# Altium schematic sheet GPIO_Shunt.SchDoc
size 209 x 297 mm
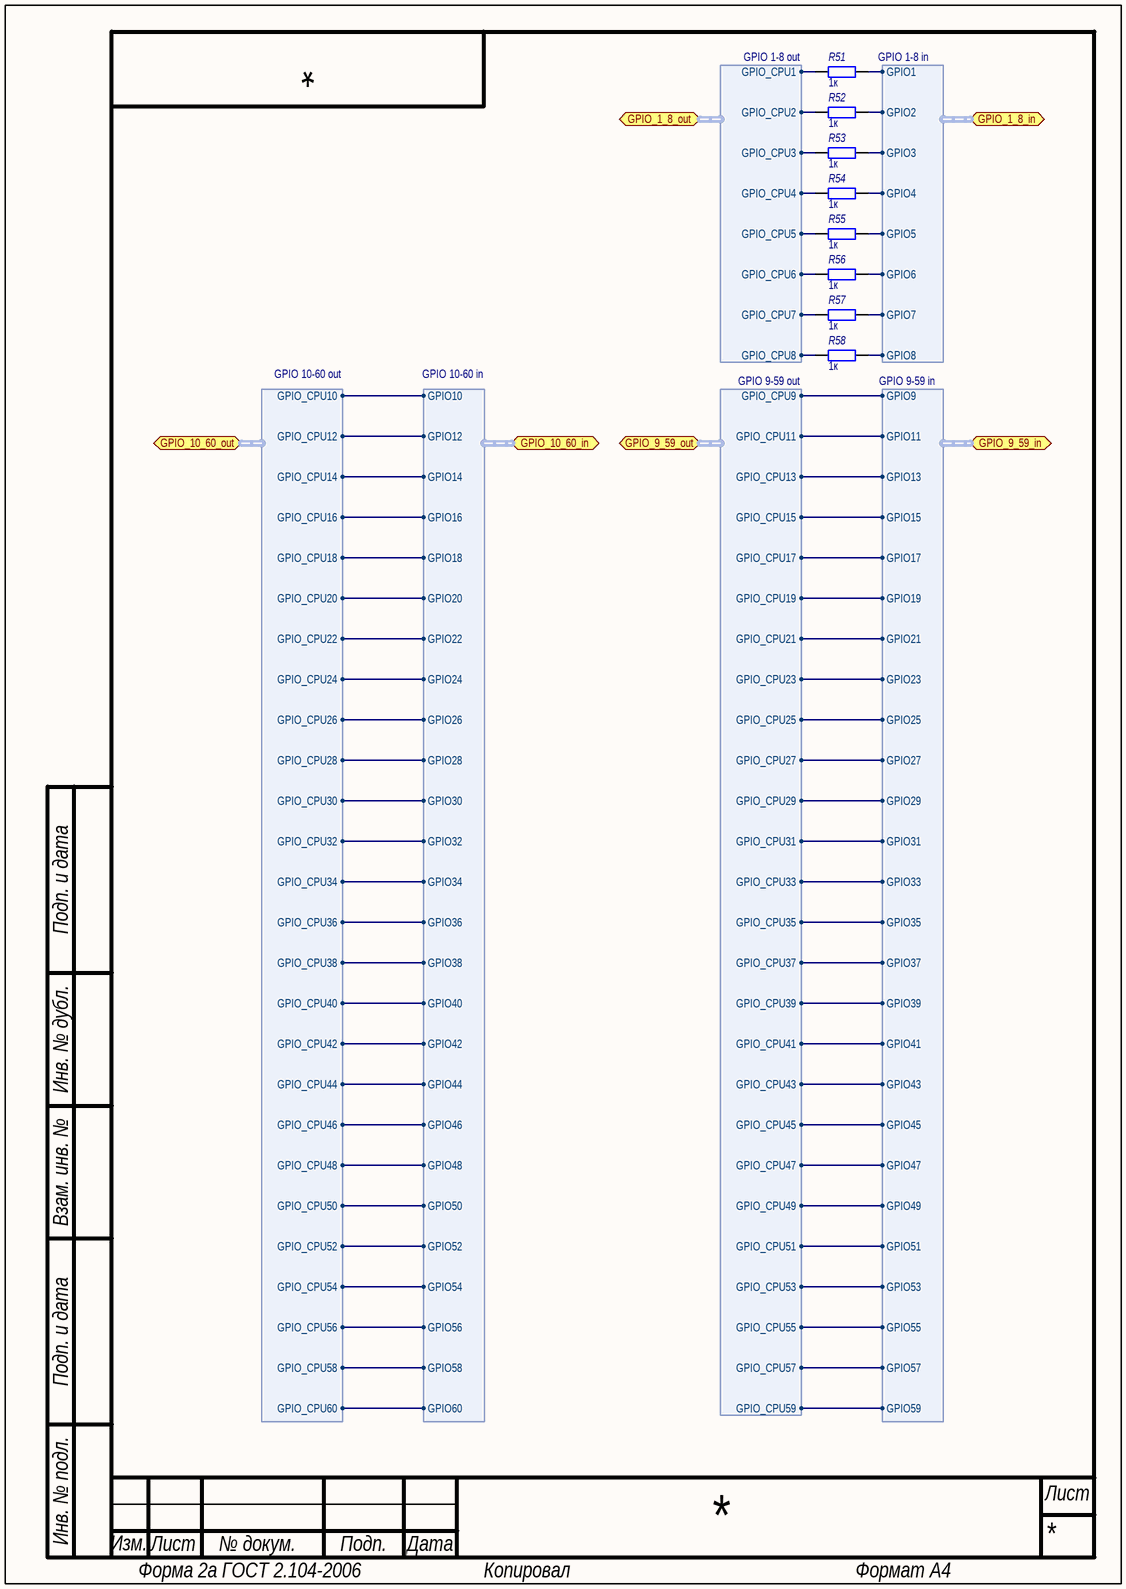
[diagram p0: GPIO_Shunt.SchDoc]

## Parts
R51  1к  [SMD_0603]
R52  1к  [SMD_0603]
R53  1к  [SMD_0603]
R54  1к  [SMD_0603]
R55  1к  [SMD_0603]
R56  1к  [SMD_0603]
R57  1к  [SMD_0603]
R58  1к  [SMD_0603]

## Ports
GPIO_1_8_in (bidir, harness GPIO 1-8 in), GPIO_1_8_out (bidir, harness GPIO 1-8 out), GPIO_9_59_in (bidir, harness GPIO 9-59 in), GPIO_9_59_out (bidir, harness GPIO 9-59 out), GPIO_10_60_in (bidir, harness GPIO 10-60 in), GPIO_10_60_out (bidir, harness GPIO 10-60 out)

## Harnesses
GPIO 1-8 in: GPIO1, GPIO2, GPIO3, GPIO4, GPIO5, GPIO6, GPIO7, GPIO8
GPIO 1-8 out: GPIO_CPU2, GPIO_CPU3, GPIO_CPU4, GPIO_CPU5, GPIO_CPU6, GPIO_CPU7, GPIO_CPU8, GPIO_CPU1
GPIO 9-59 in: GPIO11, GPIO13, GPIO15, GPIO17, GPIO19, GPIO21, GPIO23, GPIO25, GPIO27, GPIO29, GPIO31, GPIO33, GPIO35, GPIO37, GPIO39, GPIO41, GPIO43, GPIO45, GPIO47, GPIO49, GPIO51, GPIO53, GPIO55, GPIO57, GPIO59, GPIO9
GPIO 9-59 out: GPIO_CPU11, GPIO_CPU9, GPIO_CPU13, GPIO_CPU15, GPIO_CPU17, GPIO_CPU19, GPIO_CPU21, GPIO_CPU23, GPIO_CPU25, GPIO_CPU27, GPIO_CPU29, GPIO_CPU31, GPIO_CPU33, GPIO_CPU35, GPIO_CPU37, GPIO_CPU39, GPIO_CPU41, GPIO_CPU43, GPIO_CPU45, GPIO_CPU47, GPIO_CPU49, GPIO_CPU51, GPIO_CPU53, GPIO_CPU55, GPIO_CPU57, GPIO_CPU59
GPIO 10-60 in: GPIO10, GPIO12, GPIO14, GPIO16, GPIO18, GPIO20, GPIO22, GPIO24, GPIO26, GPIO28, GPIO30, GPIO32, GPIO34, GPIO36, GPIO38, GPIO40, GPIO42, GPIO44, GPIO46, GPIO48, GPIO50, GPIO52, GPIO54, GPIO56, GPIO58, GPIO60
GPIO 10-60 out: GPIO_CPU12, GPIO_CPU10, GPIO_CPU14, GPIO_CPU16, GPIO_CPU18, GPIO_CPU20, GPIO_CPU22, GPIO_CPU24, GPIO_CPU26, GPIO_CPU28, GPIO_CPU30, GPIO_CPU32, GPIO_CPU34, GPIO_CPU36, GPIO_CPU38, GPIO_CPU40, GPIO_CPU42, GPIO_CPU44, GPIO_CPU46, GPIO_CPU48, GPIO_CPU50, GPIO_CPU52, GPIO_CPU54, GPIO_CPU56, GPIO_CPU58, GPIO_CPU60

## Nets
NetR51_1: R51.1 ; port GPIO_1_8_out.GPIO_CPU1
NetR51_2: R51.2 ; port GPIO_1_8_in.GPIO1
NetR52_1: R52.1 ; port GPIO_1_8_out.GPIO_CPU2
NetR52_2: R52.2 ; port GPIO_1_8_in.GPIO2
NetR53_1: R53.1 ; port GPIO_1_8_out.GPIO_CPU3
NetR53_2: R53.2 ; port GPIO_1_8_in.GPIO3
NetR54_1: R54.1 ; port GPIO_1_8_out.GPIO_CPU4
NetR54_2: R54.2 ; port GPIO_1_8_in.GPIO4
NetR55_1: R55.1 ; port GPIO_1_8_out.GPIO_CPU5
NetR55_2: R55.2 ; port GPIO_1_8_in.GPIO5
NetR56_1: R56.1 ; port GPIO_1_8_out.GPIO_CPU6
NetR56_2: R56.2 ; port GPIO_1_8_in.GPIO6
NetR57_1: R57.1 ; port GPIO_1_8_out.GPIO_CPU7
NetR57_2: R57.2 ; port GPIO_1_8_in.GPIO7
NetR58_1: R58.1 ; port GPIO_1_8_out.GPIO_CPU8
NetR58_2: R58.2 ; port GPIO_1_8_in.GPIO8
(unnamed): port GPIO_9_59_in.GPIO11, port GPIO_9_59_out.GPIO_CPU11
(unnamed): port GPIO_9_59_in.GPIO13, port GPIO_9_59_out.GPIO_CPU13
(unnamed): port GPIO_9_59_in.GPIO15, port GPIO_9_59_out.GPIO_CPU15
(unnamed): port GPIO_9_59_in.GPIO17, port GPIO_9_59_out.GPIO_CPU17
(unnamed): port GPIO_9_59_in.GPIO19, port GPIO_9_59_out.GPIO_CPU19
(unnamed): port GPIO_9_59_in.GPIO21, port GPIO_9_59_out.GPIO_CPU21
(unnamed): port GPIO_9_59_in.GPIO23, port GPIO_9_59_out.GPIO_CPU23
(unnamed): port GPIO_9_59_in.GPIO25, port GPIO_9_59_out.GPIO_CPU25
(unnamed): port GPIO_9_59_in.GPIO27, port GPIO_9_59_out.GPIO_CPU27
(unnamed): port GPIO_9_59_in.GPIO29, port GPIO_9_59_out.GPIO_CPU29
(unnamed): port GPIO_9_59_in.GPIO31, port GPIO_9_59_out.GPIO_CPU31
(unnamed): port GPIO_9_59_in.GPIO33, port GPIO_9_59_out.GPIO_CPU33
(unnamed): port GPIO_9_59_in.GPIO35, port GPIO_9_59_out.GPIO_CPU35
(unnamed): port GPIO_9_59_in.GPIO37, port GPIO_9_59_out.GPIO_CPU37
(unnamed): port GPIO_9_59_in.GPIO39, port GPIO_9_59_out.GPIO_CPU39
(unnamed): port GPIO_9_59_in.GPIO41, port GPIO_9_59_out.GPIO_CPU41
(unnamed): port GPIO_9_59_in.GPIO43, port GPIO_9_59_out.GPIO_CPU43
(unnamed): port GPIO_9_59_in.GPIO45, port GPIO_9_59_out.GPIO_CPU45
(unnamed): port GPIO_9_59_in.GPIO47, port GPIO_9_59_out.GPIO_CPU47
(unnamed): port GPIO_9_59_in.GPIO49, port GPIO_9_59_out.GPIO_CPU49
(unnamed): port GPIO_9_59_in.GPIO51, port GPIO_9_59_out.GPIO_CPU51
(unnamed): port GPIO_9_59_in.GPIO53, port GPIO_9_59_out.GPIO_CPU53
(unnamed): port GPIO_9_59_in.GPIO55, port GPIO_9_59_out.GPIO_CPU55
(unnamed): port GPIO_9_59_in.GPIO57, port GPIO_9_59_out.GPIO_CPU57
(unnamed): port GPIO_9_59_in.GPIO59, port GPIO_9_59_out.GPIO_CPU59
(unnamed): port GPIO_9_59_in.GPIO9, port GPIO_9_59_out.GPIO_CPU9
(unnamed): port GPIO_10_60_in.GPIO10, port GPIO_10_60_out.GPIO_CPU10
(unnamed): port GPIO_10_60_in.GPIO12, port GPIO_10_60_out.GPIO_CPU12
(unnamed): port GPIO_10_60_in.GPIO14, port GPIO_10_60_out.GPIO_CPU14
(unnamed): port GPIO_10_60_in.GPIO16, port GPIO_10_60_out.GPIO_CPU16
(unnamed): port GPIO_10_60_in.GPIO18, port GPIO_10_60_out.GPIO_CPU18
(unnamed): port GPIO_10_60_in.GPIO20, port GPIO_10_60_out.GPIO_CPU20
(unnamed): port GPIO_10_60_in.GPIO22, port GPIO_10_60_out.GPIO_CPU22
(unnamed): port GPIO_10_60_in.GPIO24, port GPIO_10_60_out.GPIO_CPU24
(unnamed): port GPIO_10_60_in.GPIO26, port GPIO_10_60_out.GPIO_CPU26
(unnamed): port GPIO_10_60_in.GPIO28, port GPIO_10_60_out.GPIO_CPU28
(unnamed): port GPIO_10_60_in.GPIO30, port GPIO_10_60_out.GPIO_CPU30
(unnamed): port GPIO_10_60_in.GPIO32, port GPIO_10_60_out.GPIO_CPU32
(unnamed): port GPIO_10_60_in.GPIO34, port GPIO_10_60_out.GPIO_CPU34
(unnamed): port GPIO_10_60_in.GPIO36, port GPIO_10_60_out.GPIO_CPU36
(unnamed): port GPIO_10_60_in.GPIO38, port GPIO_10_60_out.GPIO_CPU38
(unnamed): port GPIO_10_60_in.GPIO40, port GPIO_10_60_out.GPIO_CPU40
(unnamed): port GPIO_10_60_in.GPIO42, port GPIO_10_60_out.GPIO_CPU42
(unnamed): port GPIO_10_60_in.GPIO44, port GPIO_10_60_out.GPIO_CPU44
(unnamed): port GPIO_10_60_in.GPIO46, port GPIO_10_60_out.GPIO_CPU46
(unnamed): port GPIO_10_60_in.GPIO48, port GPIO_10_60_out.GPIO_CPU48
(unnamed): port GPIO_10_60_in.GPIO50, port GPIO_10_60_out.GPIO_CPU50
(unnamed): port GPIO_10_60_in.GPIO52, port GPIO_10_60_out.GPIO_CPU52
(unnamed): port GPIO_10_60_in.GPIO54, port GPIO_10_60_out.GPIO_CPU54
(unnamed): port GPIO_10_60_in.GPIO56, port GPIO_10_60_out.GPIO_CPU56
(unnamed): port GPIO_10_60_in.GPIO58, port GPIO_10_60_out.GPIO_CPU58
(unnamed): port GPIO_10_60_in.GPIO60, port GPIO_10_60_out.GPIO_CPU60

## Notes on the sheet
- Подп. и дата
- Инв. № дубл.
- Взам. инв. №
- Инв. № подл.
- Изм.
- Лист
- № докум.
- Подп.
- Дата
- Форма 2а ГОСТ 2.104-2006
- Копировал
- Формат А4

## Library data of the parts
R51-R58 = Resistor: Наименование: Резистор; Назначение: SMD-резистор; Потребление, Вт: 0,001; Value: 1к